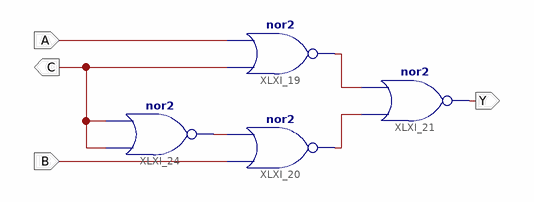
[diagram p0: schematic sheet 1]
// Xilinx ISE schematic SELECTOR.sch (spartan6) as structural Verilog: 4 symbols, 4 ports
module SELECTOR (
  input  B,
  input  A,
  output C,
  output Y
);

  wire XLXN_27, XLXN_41, XLXN_42;

  nor XLXI_19 (XLXN_42, C, A);
  nor XLXI_20 (XLXN_41, B, XLXN_27);
  nor XLXI_21 (Y, XLXN_41, XLXN_42);
  nor XLXI_24 (XLXN_27, C, C);
endmodule
